# Altium project BMS.PrjPcb
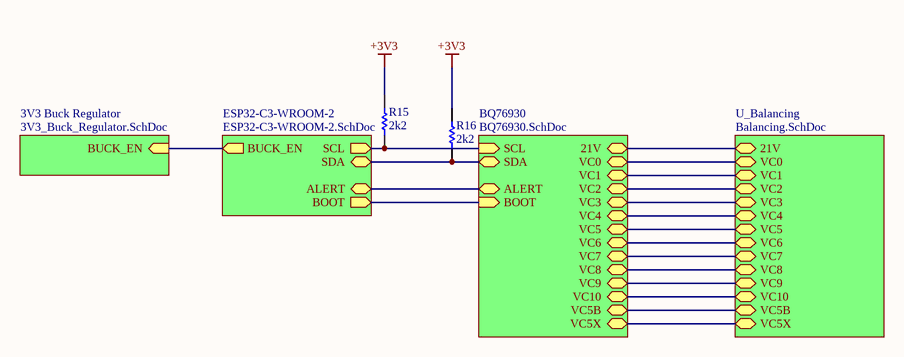
[diagram p0: Topdesign.SchDoc]
5 sheets, 125 parts. Net scope: hierarchical (ports join the sheet entries above them; power ports are global).
Board file: BMS-PCB.PcbDoc
Sheets:
  Topdesign.SchDoc
    ESP32-C3-WROOM-2 = ESP32-C3-WROOM-2.SchDoc
    BQ76930 = BQ76930.SchDoc
    3V3 Buck Regulator = 3V3_Buck_Regulator.SchDoc
    U_Balancing = Balancing.SchDoc

## Sheet Topdesign.SchDoc
size A4; SheetNumber: 1; SheetTotal: 5

### Parts
R15  value 2k2  [Wurth 0603 Resistor]  (hidden comment: Generic Resistor 2k2 0603)
R16  value 2k2  [Wurth 0603 Resistor]  (hidden comment: Generic Resistor 2k2 0603)

### Sub-sheets
3V3 Buck Regulator = 3V3_Buck_Regulator.SchDoc: BUCK_EN (in)
BQ76930 = BQ76930.SchDoc: SCL (in), SDA (bidir), BOOT (in), ALERT (bidir), VC5X (bidir), VC0 (bidir), VC1 (bidir), VC2 (bidir), VC3 (bidir), VC4 (bidir), VC5 (bidir), VC6 (bidir), VC7 (bidir), VC8 (bidir), VC9 (bidir), VC10 (bidir), VC5B (bidir), 21V (bidir)
ESP32-C3-WROOM-2 = ESP32-C3-WROOM-2.SchDoc: SCL (out), SDA (bidir), ALERT (bidir), BOOT (out), BUCK_EN (out)
U_Balancing = Balancing.SchDoc: VC0 (bidir), VC1 (bidir), VC2 (bidir), VC3 (bidir), VC4 (bidir), VC5 (bidir), VC6 (bidir), VC7 (bidir), VC8 (bidir), VC9 (bidir), VC10 (bidir), VC5B (bidir), 21V (bidir), VC5X (bidir)

### Nets
+3V3: R15.2 R16.2
21V: sheet BQ76930/21V, sheet U_Balancing/21V
KEEP_ON: sheet ESP32-C3-WROOM-2/BUCK_EN, sheet 3V3 Buck Regulator/BUCK_EN
VC5X: sheet BQ76930/VC5X, sheet U_Balancing/VC5X
NetC17_1: sheet BQ76930/VC4, sheet U_Balancing/VC4
NetC17_2: sheet BQ76930/VC5, sheet U_Balancing/VC5
NetC18_1: sheet BQ76930/VC9, sheet U_Balancing/VC9
NetC18_2: sheet BQ76930/VC10, sheet U_Balancing/VC10
NetC19_1: sheet BQ76930/VC3, sheet U_Balancing/VC3
NetC20_1: sheet BQ76930/VC8, sheet U_Balancing/VC8
NetC21_1: sheet BQ76930/VC2, sheet U_Balancing/VC2
NetC22_1: sheet BQ76930/VC7, sheet U_Balancing/VC7
NetC23_1: sheet BQ76930/VC1, sheet U_Balancing/VC1
NetC24_1: sheet BQ76930/VC6, sheet U_Balancing/VC6
NetC27_2: sheet BQ76930/VC0, sheet U_Balancing/VC0
NetC28_1: sheet BQ76930/VC5B, sheet U_Balancing/VC5B
NetD5_1: sheet ESP32-C3-WROOM-2/BOOT, sheet BQ76930/BOOT
NetIC2_4: R16.1 ; sheet ESP32-C3-WROOM-2/SDA, sheet BQ76930/SDA
NetIC2_5: R15.1 ; sheet ESP32-C3-WROOM-2/SCL, sheet BQ76930/SCL
NetIC2_30: sheet ESP32-C3-WROOM-2/ALERT, sheet BQ76930/ALERT

## Sheet ESP32-C3-WROOM-2.SchDoc
size A4; SheetNumber: 2; SheetTotal: 5
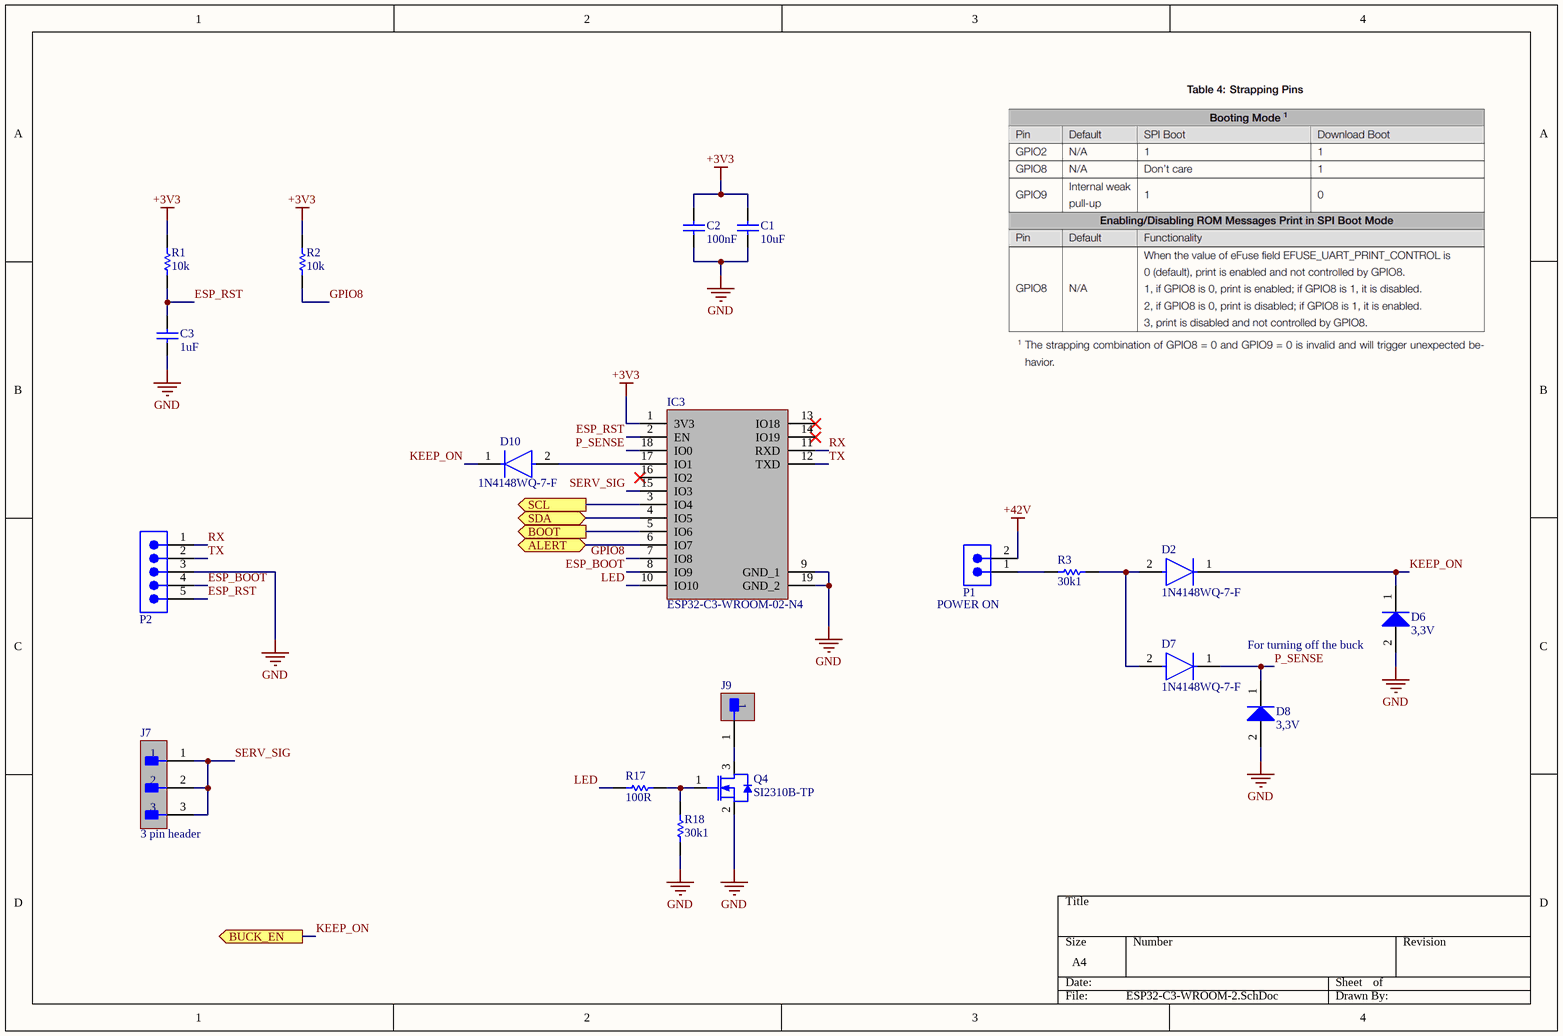
[diagram p1: ESP32-C3-WROOM-2.SchDoc]

### Parts
C1  value 10uF  [Wurth 0603 capacitor]  (hidden comment: Generic Capacitor 10uF 0603)
C2  value 100nF  [Wurth 0603 capacitor]  (hidden comment: Generic Capacitor 100nF 0603)
C3  value 1uF  [Wurth 0603 capacitor]  (hidden comment: Generic Capacitor 1uF 0603)
D2  1N4148WQ-7-F  [FP-SOD123-MFG]
D6  value 3,3V  [SOD-123]  (hidden comment: BZT52C3V3)
D7  1N4148WQ-7-F  [FP-SOD123-MFG]
D8  value 3,3V  [SOD-123]  (hidden comment: BZT52C3V3)
D10  1N4148WQ-7-F  [FP-SOD123-MFG]
IC3  ESP32-C3-WROOM-02-N4  [Espressif ESP32C3WROOM02N4]
J7  3 pin header  [3 pin header 2.54mm]
J9  1 pin header  [1 pin header]  (value not drawn)
P1  POWER ON  [2x1 2.54mm M]
P2  61300511121  [5x1 2.54mm]  (value not drawn)
Q4  SI2310B-TP  [MCC SOT-23-3]
R1  value 10k  [Wurth 0603 Resistor]  (hidden comment: Generic Resistor 10k 0603)
R2  value 10k  [Wurth 0603 Resistor]  (hidden comment: Generic Resistor 10k 0603)
R3  value 30k1  [Wurth 0603 Resistor]  (hidden comment: Generic Resistor 30k1 0603)
R17  value 100R  [Wurth 0603 Resistor]  (hidden comment: Generic Resistor 100R 0603)
R18  value 30k1  [Wurth 0603 Resistor]  (hidden comment: Generic Resistor 30k1 0603)

### Ports
ALERT (bidir), BOOT (out), BUCK_EN (out), SCL (out), SDA (bidir)

### Nets
+3V3: C1.2 C2.2 IC3.1(3V3) R1.2 R2.2
+42V: P1.2
GND: C1.1 C2.1 C3.1 D6.2(A) D8.2(A) IC3.9(GND_1) IC3.19(GND_2) P2.3 Q4.2(S) R18.1
ESP_BOOT: IC3.8(IO9) P2.4
ESP_RST: C3.2 IC3.2(EN) P2.5 R1.1
GPIO8: IC3.7(IO8) R2.1
KEEP_ON: D2.1(C) D6.1(K) D10.1(C) ; port BUCK_EN
LED: IC3.10(IO10) R17.1
P_SENSE: D7.1(C) D8.1(K) IC3.18(IO0)
RX: IC3.11(RXD) P2.1
SERV_SIG: IC3.15(IO3) J7.1 J7.2 J7.3
TX: IC3.12(TXD) P2.2
NetD2_2: D2.2(A) D7.2(A) R3.2
NetD5_1: IC3.5(IO6) ; port BOOT
NetD10_2: D10.2(A) IC3.17(IO1)
NetIC2_4: IC3.4(IO5) ; port SDA
NetIC2_5: IC3.3(IO4) ; port SCL
NetIC2_30: IC3.6(IO7) ; port ALERT
NetJ9_1: J9.1 Q4.3(D)
NetP1_1: P1.1 R3.1
NetQ4_1: Q4.1(G) R17.2 R18.2

Not connected (* = marked no-connect by the designer): IC3 13(IO18)* 14(IO19)* 16(IO2)*

### Notes on the sheet
- (near D6) For turning off the buck

### Library data of the parts
D2 D7 D10 = CMP-12791-000025-1: DIODE GEN PURP 100V 300MA SOD123; Manufacturer: Diodes Inc.; Value: 2pF; Standoff Height: 0mm; Automotive Grade: Grade 0; Max Junction Temp: +150°C; Max Surge Forward Current: 1A; Peak Reverse Current: 1uA; Forward Current: 300mA; Temperature: -65°C to +150°C; Device Class L3: Rectifier Diodes; Manufacturer Part Number: 1N4148WQ-7-F; Temperature Range Low: -65°C; Device Class L1: Discrete Semiconductors; Reverse Voltage: 100V; Automotive: Yes; Temperature Range High: +150°C; Octopart: https://octopart.com/1n4148wq-7-f-diodes+inc.-34965875; ComponentLink2URL: https://www.diodes.com/assets/Datasheets/ds30086.pdf; Max Repetitive Reverse Voltage: 100V; Mouser Description: Diode Switching 100V 0.15A Automotive 2-Pin SOD-123 T/R; Ipc Land Pattern Name: SOD365155X123-2; RoHS: TRUE; Height: 1.45mm; ComponentLink2Description: Datasheet; Category: Diode; Footprint Url: https://www.diodes.com/assets/Package-Files/SOD123.pdf; Package: SOD123; Device Class L2: Diodes; Lead Free: Yes; Capacitance: 2pF; Digikey Description: DIODE GEN PURP 100V 300MA SOD123
D6 D8 = GOODWORK BZT52C3V3
IC3 = Espressif ESP32-C3-WROOM-02-N4: Integrated Circuit; Manufacturer_Name: Espressif Systems; Datasheet Link: https://www.mouser.ch/datasheet/2/891/Espressif_ESP32_C3_WROOM_02-2006871.pdf; Height: 3.35mm; Manufacturer_Part_Number: ESP32-C3-WROOM-02-N4; Mouser Part Number: 356-ESP32C3WROOM02N4; Mouser Price/Stock: https://www.mouser.co.uk/ProductDetail/Espressif-Systems/ESP32-C3-WROOM-02-N4?qs=stqOd1AaK7%2FqjTZKEOgfUg%3D%3D; Supplier: Mouser; Supplier Part Number: 356-ESP32C3WROOM02N4
P1 = 2P: WR-PHD Pin Header, THT, Vertical, pitch 2.54mm, 1 Row, 2P; Manufacturer Part Number: 61300211121; Manufacturer: Wurth Elektronik; Contact Resistance: 20mOhm; Rated Current: 3A; Working Voltage: 250V; Withstanding Voltage: 500V; Category: Board-to-Board Connectors; Match Code: WR-PHD; ComponentLink1Description: Website Link; ComponentLink1URL: https://www.we-online.com/redexpert/article/61300211121?ad; ComponentLink2Description: Datasheet Link; ComponentLink2URL: https://www.we-online.com/redexpert/spec/61300211121?ad; Mount: Through Hole; Operating Temperature Max: 105°C; Operating Temperature Min: -40°C; Packaging: Bag; Gender: Pin Header; Number of Pins: 2; Number of Rows: 1; Orientation: Vertical; Pitch: 2.54mm
P2 = 5P: WR-PHD Pin Header, THT, Vertical, pitch 2.54mm, 1 Row, 5P; Manufacturer: Wurth Elektronik; Contact Resistance: 20mOhm; Rated Current: 3A; Working Voltage: 250V; Withstanding Voltage: 500V; Manufacturer Part Number: 61300511121; Category: Board-to-Board Connectors; Match Code: WR-PHD; ComponentLink1Description: Website Link; ComponentLink1URL: https://www.we-online.com/redexpert/article/61300511121?ad; ComponentLink2Description: Datasheet Link; ComponentLink2URL: https://www.we-online.com/redexpert/spec/61300511121?ad; Mount: Through Hole; Operating Temperature Max: 105°C; Operating Temperature Min: -40°C; Packaging: Bag; Gender: Pin Header; Number of Pins: 5; Number of Rows: 1; Orientation: Vertical; Pitch: 2.54mm
Q4 = MCC SI2310B-TP: Power Field-Effect Transistor; Manufacturer: MCC; Supplier: Digikey; Supplier Part Number: 353-SI2310B-TPCT-ND; Manufacturer Part Number: SI2310B-TP; RoHS: Yes; Stock: 114263; Pricing: 1=0,36, 10=0,255, 100=0,1286, 500=0,10488, 1000=0,07782 (USD)

## Sheet BQ76930.SchDoc
size A4; SheetNumber: 3; SheetTotal: 5
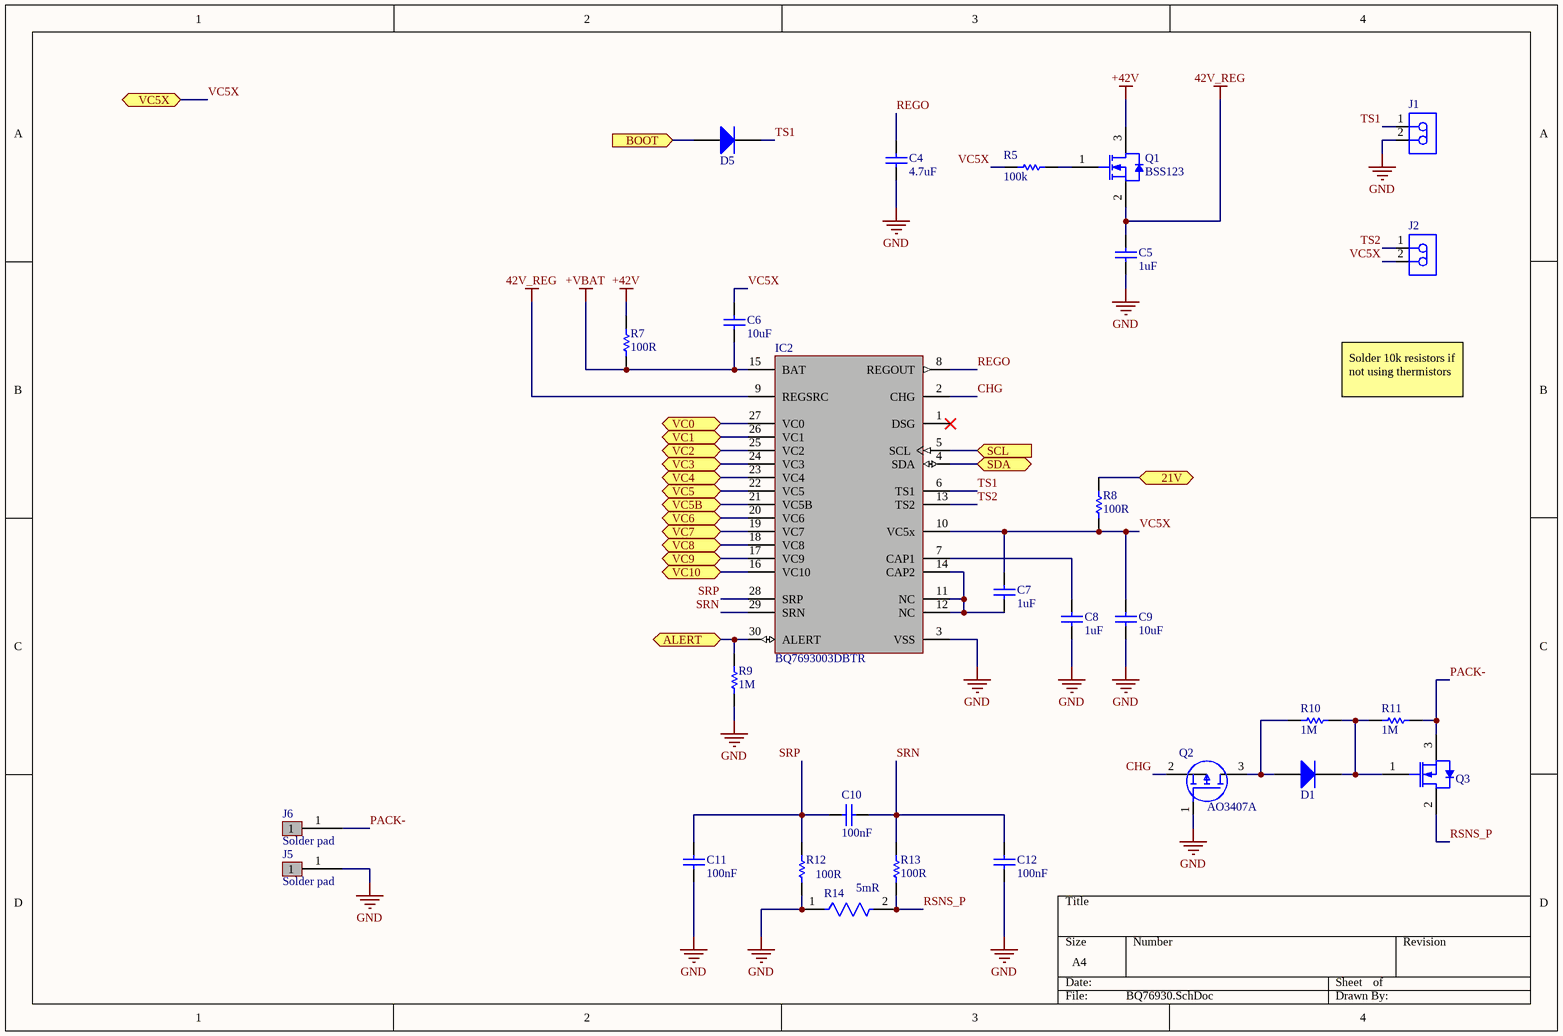
[diagram p2: BQ76930.SchDoc]

### Parts
C4  value 4.7uF  [Wurth 0603 capacitor]  (hidden comment: Generic Capacitor 4.7uF 0603)
C5  value 1uF  [Wurth 0603 capacitor]  (hidden comment: Generic Capacitor 1uF 0603)
C6  value 10uF  [Wurth 0603 capacitor]  (hidden comment: Generic Capacitor 10uF 0603)
C7  value 1uF  [Wurth 0603 capacitor]  (hidden comment: Generic Capacitor 1uF 0603)
C8  value 1uF  [Wurth 0603 capacitor]  (hidden comment: Generic Capacitor 1uF 0603)
C9  value 10uF  [Wurth 0603 capacitor]  (hidden comment: Generic Capacitor 10uF 0603)
C10  value 100nF  [Wurth 0603 capacitor]  (hidden comment: Generic Capacitor 100nF 0603)
C11  value 100nF  [Wurth 0603 capacitor]  (hidden comment: Generic Capacitor 100nF 0603)
C12  value 100nF  [Wurth 0603 capacitor]  (hidden comment: Generic Capacitor 100nF 0603)
D1  1N4148W-7-F  [DIOD-SOD123-2_V]  (value not drawn)
D5  1N4148W-7-F  [DIOD-SOD123-2_V]  (value not drawn)
IC2  BQ7693003DBTR  [Texas Instruments TSSOP-30 7.8X4.4MM]
J1  B2B-PH-K-S(LF)(SN)  [JST-B2B-PH-K-S_V]  (value not drawn)
J2  B2B-PH-K-S(LF)(SN)  [JST-B2B-PH-K-S_V]  (value not drawn)
J5  Solder pad  [Solder Pad 4X5MM]
J6  Solder pad  [Solder Pad 4X5MM]
Q1  BSS123  [FAIR-SOT23-3_V]
Q2  AO3407A  [UMW SOT23-3]
Q3  MDT18N20  [Minos TO-252-2L 6.3X9.6MM]  (value not drawn)
R5  value 100k  [Wurth 0603 Resistor]  (hidden comment: CRCW060310K0FKEA)
R7  value 100R  [Wurth 0603 Resistor]  (hidden comment: Generic Resistor 100R 0603)
R8  value 100R  [Wurth 0603 Resistor]  (hidden comment: Generic Resistor 100R 0603)
R9  value 1M  [Wurth 0603 Resistor]  (hidden comment: Generic Resistor 1M 0603)
R10  value 1M  [Wurth 0603 Resistor]  (hidden comment: Generic Resistor 1M 0603)
R11  value 1M  [Wurth 0603 Resistor]  (hidden comment: Generic Resistor 1M 0603)
R12  value 100R  [Wurth 0603 Resistor]  (hidden comment: Generic Resistor 100R 0603)
R13  value 100R  [Wurth 0603 Resistor]  (hidden comment: Generic Resistor 100R 0603)
R14  Resistance: 5mR  [FP-ERJM1WS-MFG]  (hidden comment: ERJ-M1WSF5M0U)

### Ports
21V (bidir), ALERT (bidir), BOOT (in), SCL (in), SDA (bidir), VC0 (bidir), VC1 (bidir), VC2 (bidir), VC3 (bidir), VC4 (bidir), VC5 (bidir), VC5B (bidir), VC5X (bidir), VC6 (bidir), VC7 (bidir), VC8 (bidir), VC9 (bidir), VC10 (bidir)

### Nets
42V_REG: C5.2 IC2.9(REGSRC) Q1.2(S)
+42V: Q1.3(D) R7.1
+VBAT: C6.1 IC2.15(BAT) R7.2
GND: C4.1 C5.1 C8.1 C9.1 C11.1 C12.1 IC2.3(VSS) J1.2 J5.1 Q2.1(G) R9.1 R12.1 R14.1
21V: R8.2 ; port 21V
CHG: IC2.2(CHG) Q2.2(S)
PACK-: J6.1 Q3.3(S) R11.2
REGO: C4.2 IC2.8(REGOUT)
RSNS_P: Q3.2(D) R13.1 R14.2
SRN: C10.2 C12.2 IC2.29(SRN) R13.2
SRP: C10.1 C11.2 IC2.28(SRP) R12.2
TS1: D5.2(K) IC2.6(TS1) J1.1
TS2: IC2.13(TS2) J2.1
VC5X: C6.2 C7.2 C9.2 IC2.10(VC5x) J2.2 R5.2 R8.1 ; port VC5X
NetC7_1: C7.1 IC2.11(NC) IC2.12(NC) IC2.14(CAP2)
NetC8_2: C8.2 IC2.7(CAP1)
NetC17_1: IC2.23(VC4) ; port VC4
NetC17_2: IC2.22(VC5) ; port VC5
NetC18_1: IC2.17(VC9) ; port VC9
NetC18_2: IC2.16(VC10) ; port VC10
NetC19_1: IC2.24(VC3) ; port VC3
NetC20_1: IC2.18(VC8) ; port VC8
NetC21_1: IC2.25(VC2) ; port VC2
NetC22_1: IC2.19(VC7) ; port VC7
NetC23_1: IC2.26(VC1) ; port VC1
NetC24_1: IC2.20(VC6) ; port VC6
NetC27_2: IC2.27(VC0) ; port VC0
NetC28_1: IC2.21(VC5B) ; port VC5B
NetD1_1: D1.1(A) Q2.3(D) R10.1
NetD1_2: D1.2(K) Q3.1(G) R10.2 R11.1
NetD5_1: D5.1(A) ; port BOOT
NetIC2_4: IC2.4(SDA) ; port SDA
NetIC2_5: IC2.5(SCL) ; port SCL
NetIC2_30: IC2.30(ALERT) R9.2 ; port ALERT
NetQ1_1: Q1.1(G) R5.1

Not connected (* = marked no-connect by the designer): IC2 1(DSG)*

### Notes on the sheet
- Solder 10k resistors if not using thermistors

### Library data of the parts
D1 D5 = CMP-2000-04932-2: Fast Switching Diode, 100 V, 0.15 A, -65 to 150 degC, 2-Pin?SOD123, RoHS, Tape and Reel; Recovery Time: 4ns; Brand: DiodesIncorporated; Unit Weight: 0.000353oz; Max Surge Current: 2A; Peak Reverse Voltage: 100V; Ir - Reverse Current: 1uA; Vf - Forward Voltage: 1.25V; Configuration: Single; If - Forward Current: 0.15A; Product Category: Diodes-GeneralPurpose,Power,Switching; Operating Temperature Range: -65Cto+150C; Packaging: Reel; Manufacturer URL: http://www.diodes.com/; Maximum Operating Temperature: +150C; Height: 1.25mm; Minimum Operating Temperature: -65C; Product: SwitchingDiodes; Package URL: http://www.diodes.com/datasheets/ds18004.pdf; Type: SwitchingDiode; Package Reference: SOD123-2; Width: 1.7mm; Datasheet URL: http://www.farnell.com/datasheets/1915529.pdf; Datasheet Version: Rev. 24-2, 10/2013; Series: 1N4148; Factory Pack Quantity: 3000; Length: 2.85mm; RoHS: True; Manufacturer: DiodesIncorporated; Mounting Style: SMD/SMT; Package / Case: SOD-123
IC2 = Texas instruments BQ7693003DBTR: Power Supply Support Circuit, Adjustable, 1 Channel, PDSO30; Max Supply Voltage: 25V; Nominal Supply Current: 40-130uA; Number Of Outputs: 2; Number Of Cells: 10; Standoff Height: 0.05mm; Min Supply Voltage: 6V; Package Body Material: Plastic; Adjustable Threshold: Yes; Number of Channels: 1; Octopart: https://octopart.com/bq7693003dbtr-texas+instruments-34472212; Digikey Description: IC BATT MGMT LI-ION AFE 30TSSOP; Manufacturer: Texas Instruments; Ipc Land Pattern Name: SOP50P635X120-30; Mouser Description: 6 to 10-Series Cell Li-Ion and Li-Phosphate Battery Monitor (bq76940 Family) 30-TSSOP -40 to 85; Package: DBT0030A; Manufacturer Part Number: BQ7693003DBTR; Device Class L1: Integrated Circuits (ICs); Temperature Range High: +85°C; RoHS: TRUE; Category: IC; Temperature: -40°C to +85°C; Automotive: No; Device Class L3: Battery Management; ComponentLink2Description: Datasheet; Device Class L2: Power Management ICs; ComponentLink2URL: http://www.ti.com/lit/ds/symlink/bq76930.pdf; Height: 1.2mm; Temperature Range Low: -40°C; Lead Free: Yes; Supplier: Mouser; Supplier Part Number: 595-BQ7693003DBTR; Stock: 4010; Pricing: 1=3,18, 10=2,75, 50=2,75, 100=2,54, 1000=2,15, 10000=1,96 (USD); Case/Package: TSSOP; Pins: 30; Package Shape: Rectangular; Terminal Finish: Nickel; Min Operating Temperature: -40°C; Max Operating Temperature: 85°C; JESD-609 Code: e4; Throw Configuration: POWER SUPPLY SUPPORT CIRCUIT; Moisture Sensitivity Level: 2; Channels: 1; Package Style: SMALL OUTLINE, THIN PROFILE, SHRINK PITCHMeter; Peak Reflow Temperature (Cel): 260°C; Surface Mount: Yes; Terminal Form: Gull Wing; Terminal Position: DUAL; Length: 7.8mm; Width: 4.4mm; Height - Seated (Max): 1.2mm; Terminal Pitch: 0.5mm; Reach SVHC Compliant: Yes; RoHS Compliant: Yes; Temperature Grade: INDUSTRIAL; ComponentLink1URL: https://www.ti.com:443/lit/ds/symlink/bq76920.pdf?src-supplier=IHS+Markit; ComponentLink1Description: https://www.ti.com:443/lit/ds/symlink/bq76920.pdf?src-supplier=IHS+Markit; ComponentLink3URL: http://www.ti.com/lit/gpn/bq76930?src-supplier=Mouser; ComponentLink3Description: http://www.ti.com/lit/gpn/bq76930?src-supplier=Mouser; ComponentLink4URL: http://www.ti.com/lit/ds/symlink/bq76930.pdf?src-supplier=Digikey; ComponentLink4Description: http://www.ti.com/lit/ds/symlink/bq76930.pdf?src-supplier=Digikey; ComponentLink5URL: http://www.ti.com/lit/pdf/slpt038?src-supplier=Digikey; ComponentLink5Description: http://www.ti.com/lit/pdf/slpt038?src-supplier=Digikey; ComponentLink6URL: http://www.ti.com/general/docs/lit/getliterature.tsp?genericPartNumber=BQ76920&&fileType=pdf&src-supplier=Avnet; ComponentLink6Description: http://www.ti.com/general/docs/lit/getliterature.tsp?genericPartNumber=BQ76920&&fileType=pdf&src-supplier=Avnet
J1 J2 = CMP-2000-05162-1: Male Header, Pitch 2 mm, 1 x 2 Position, Height 6 mm, Tail Length 3.4 mm, -25 to 85 degC, RoHS, Bulk; Manufacturer: JST; Pitch: 2mm; Style/Orientation: StraightHeader/Plug; No of Positions: 2; Datasheet Version: Nov-08; Datasheet URL: http://datasheet.octopart.com/B2B-PH-K-S%28LF%29%28SN%29-JST-datasheet-8324864.pdf; Manufacturer URL: http://www.jst.com/home2.html; Type: ShroudedHeader; Termination: Crimp
Q1 = CMP-2000-04934-1: N-Channel Logic Level Enhancement Mode Field Effect Transistor, 1.7 V, -55 to 150 degC, 3-Pin SOT-23, RoHS, Tape and Reel; Manufacturer: Fairchild; Channel Type: N; Typical Turn-Off Delay Time: 17ns; Maximum Continuous Drain Current: 0.17A; Rad Hard: No; Typical Rise Time: 9ns; Typical Fall Time: 2.4ns; Maximum Gate Source Voltage: ±20V; Maximum Drain Source Voltage: 100V; Typical Turn-On Delay Time: 1.7ns; RDS-on: 6000@10VmOhm; Package Version: Rev. 12, 03/2016; Packaging: Tape&Reel; Package Reference: SOT23-3; Channel Mode: Enhancement; Operating Temperature: -55to150degC; Package Description: 3-Pin Small Outline Transistor, Body 2.92 x 1.325 mm, Pitch 0.95 mm; Category: MOSFET; Datasheet Version: Jun-03; Datasheet URL: https://www.fairchildsemi.com/datasheets/BS/BSS123.pdf; Manufacturer URL: https://www.fairchildsemi.com/; Mounting: SurfaceMount; Package: 3SOT-23; Package URL: http://www.fairchildsemi.com/dwg/MA/MA03D.pdf
Q2 = UMW AO3407A: MOSFET (P-Channel); Manufacturer_Name: Alpha & Omega Semiconductors; Datasheet Link: http://www.aosmd.com/pdfs/datasheet/ao3407a.pdf; Height: 1.25mm; Manufacturer_Part_Number: AO3407A; Arrow Part Number: AO3407A; Arrow Price/Stock: https://www.arrow.com/en/products/ao3407a/alpha-and-omega-semiconductor?region=nac
Q3 = Minos MDT18N20: VDS = 200V,ID = 18A, VGS=30V
R5 = Generic Resistor 100k 0603
R14 = CMP-05422-000103-1: RES 0.005 OHM 1% 1W 2512; Temperature Coefficient: 100ppm/°C; Construction: Rectangular; Mount: Surface Mount; Case/Package: 2512; Package Quantity: 1; Technology: THICK FILM; RoHS Compliant: Yes; REACH SVHC: No SVHC; Size Code: 2512; Number of Terminations: 2; Max Operating Temperature: 170°C; Number of Pins: 2; Case Code (Metric): 6432; Depth: 3.2mm; Case Code (Imperial): 2512; Max Power Dissipation: 1W; Termination: SMD/SMT; Power Rating: 1W; Radiation Hardening: No; Tolerance: 1%; Packaging: Tape and Reel; Resistor Type: Metal Strip; Military Standard: Not; Lead Free: Lead Free; Height: 0.8mm; Min Operating Temperature: -55°C; Width: 3.2mm; Series: ERJ; Length: 6.4mm; Resistance Tolerance: 1%; Contact Plating: Tin

## Sheet 3V3_Buck_Regulator.SchDoc
size A4; SheetNumber: 4; SheetTotal: 5
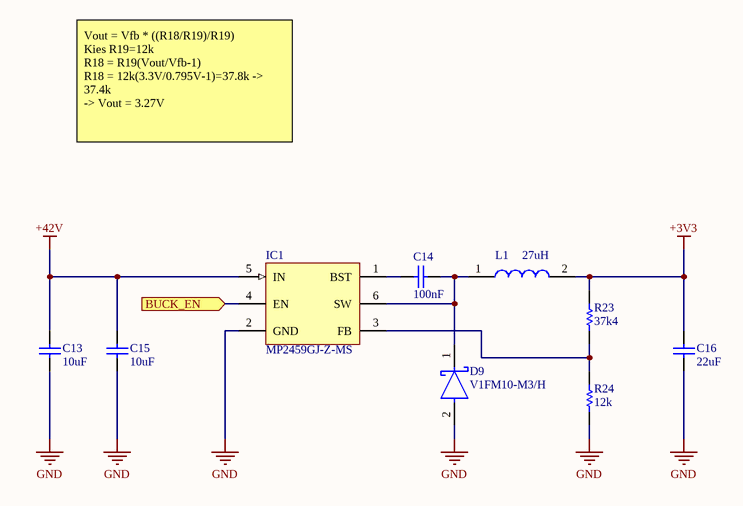
[diagram p3: 3V3_Buck_Regulator.SchDoc]

### Parts
C13  value 10uF  [Wurth 0805 capacitor]  (hidden comment: Generic Capacitor 10uF 0805)
C14  value 100nF  [Wurth 0603 capacitor]  (hidden comment: Generic Capacitor 100nF 0603)
C15  value 10uF  [Wurth 0805 capacitor]  (hidden comment: Generic Capacitor 10uF 0805)
C16  value 22uF  [Wurth 0805 capacitor]  (hidden comment: Generic Capacitor 22uF 0805)
D9  V1FM10-M3/H  [FP-V1FM10-M3-H-MFG]
IC1  MP2459GJ-Z-MS  [Texas InstrumentsSOT95P280X110-6N]
L1  value 27uH  [3L COILS 5.2X5.8MM]  (hidden comment: COILS SMTDR54-270M)
R23  value 37k4  [Wurth 0603 Resistor]  (hidden comment: Generic Resistor 37k4 0603)
R24  value 12k  [Wurth 0603 Resistor]  (hidden comment: Generic Resistor 12k 0603)

### Ports
BUCK_EN (in)

### Nets
+3V3: C16.2 L1.2 R23.2
+42V: C13.2 C15.2 IC1.5(IN)
GND: C13.1 C15.1 C16.1 D9.2(A) IC1.2(GND) R24.1
KEEP_ON: IC1.4(EN) ; port BUCK_EN
NetC14_1: C14.1 IC1.1(BST)
NetC14_2: C14.2 D9.1(C) IC1.6(SW) L1.1
NetIC1_3: IC1.3(FB) R23.1 R24.2

### Notes on the sheet
- Vout = Vfb * ((R18/R19)/R19)
  Kies R19=12k
  R18 = R19(Vout/Vfb-1)
  R18 = 12k(3.3V/0.795V-1)=37.8k -> 37.4k
  -> Vout = 3.27V

### Library data of the parts
D9 = CMP-02539-000045-1: 1A 100V SMF TRENCH SKY RECT; RoHS Compliant: Yes
IC1 = MSKSEMI MP2459GJ-Z-MS: Buck Converter 4.5V-60V 600mA
L1 = 3L COILS SMTDR54-270M inductor: Manufacturer: 3L Coils

## Sheet Balancing.SchDoc
size A4; SheetNumber: 5; SheetTotal: 5
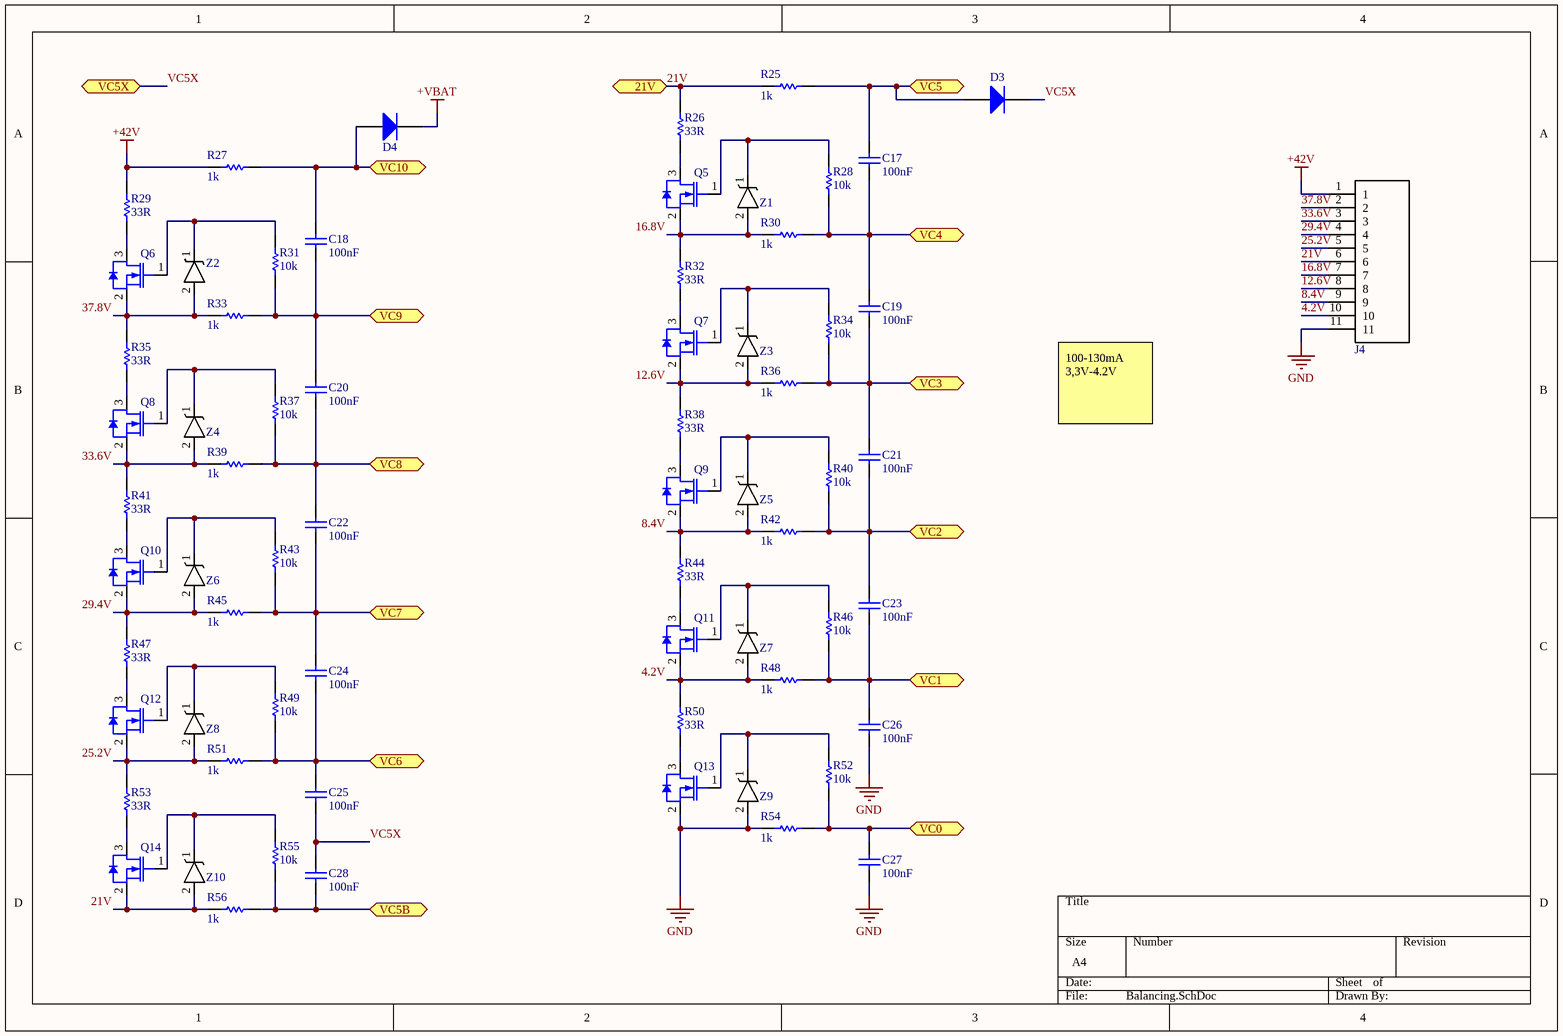
[diagram p4: Balancing.SchDoc]

### Parts
C17  value 100nF  [Wurth 0603 capacitor]  (hidden comment: Generic Capacitor 100nF 0603)
C18  value 100nF  [Wurth 0603 capacitor]  (hidden comment: Generic Capacitor 100nF 0603)
C19  value 100nF  [Wurth 0603 capacitor]  (hidden comment: Generic Capacitor 100nF 0603)
C20  value 100nF  [Wurth 0603 capacitor]  (hidden comment: Generic Capacitor 100nF 0603)
C21  value 100nF  [Wurth 0603 capacitor]  (hidden comment: Generic Capacitor 100nF 0603)
C22  value 100nF  [Wurth 0603 capacitor]  (hidden comment: Generic Capacitor 100nF 0603)
C23  value 100nF  [Wurth 0603 capacitor]  (hidden comment: Generic Capacitor 100nF 0603)
C24  value 100nF  [Wurth 0603 capacitor]  (hidden comment: Generic Capacitor 100nF 0603)
C25  value 100nF  [Wurth 0603 capacitor]  (hidden comment: Generic Capacitor 100nF 0603)
C26  value 100nF  [Wurth 0603 capacitor]  (hidden comment: Generic Capacitor 100nF 0603)
C27  value 100nF  [Wurth 0603 capacitor]  (hidden comment: Generic Capacitor 100nF 0603)
C28  value 100nF  [Wurth 0603 capacitor]  (hidden comment: Generic Capacitor 100nF 0603)
D3  1N4148W-7-F  [DIOD-SOD123-2_V]  (value not drawn)
D4  1N4148W-7-F  [DIOD-SOD123-2_V]  (value not drawn)
J4  S11B-PH-K-S_LF__SN_  [S11BPHKSLFSN]  (value not drawn)
Q5  DMN2004K-7  [Diodes SOT23-3]  (value not drawn)
Q6  DMN2004K-7  [Diodes SOT23-3]  (value not drawn)
Q7  DMN2004K-7  [Diodes SOT23-3]  (value not drawn)
Q8  DMN2004K-7  [Diodes SOT23-3]  (value not drawn)
Q9  DMN2004K-7  [Diodes SOT23-3]  (value not drawn)
Q10  DMN2004K-7  [Diodes SOT23-3]  (value not drawn)
Q11  DMN2004K-7  [Diodes SOT23-3]  (value not drawn)
Q12  DMN2004K-7  [Diodes SOT23-3]  (value not drawn)
Q13  DMN2004K-7  [Diodes SOT23-3]  (value not drawn)
Q14  DMN2004K-7  [Diodes SOT23-3]  (value not drawn)
R25  value 1k  [Wurth 0603 Resistor]  (hidden comment: CRCW060310K0FKEA)
R26  value 33R  [FOJAN 2010 Resistor]  (hidden comment: FRC2010F33R0TS)
R27  value 1k  [Wurth 0603 Resistor]  (hidden comment: CRCW060310K0FKEA)
R28  value 10k  [Wurth 0603 Resistor]  (hidden comment: Generic Resistor 10k 0603)
R29  value 33R  [FOJAN 2010 Resistor]  (hidden comment: FRC2010F33R0TS)
R30  value 1k  [Wurth 0603 Resistor]  (hidden comment: CRCW060310K0FKEA)
R31  value 10k  [Wurth 0603 Resistor]  (hidden comment: Generic Resistor 10k 0603)
R32  value 33R  [FOJAN 2010 Resistor]  (hidden comment: FRC2010F33R0TS)
R33  value 1k  [Wurth 0603 Resistor]  (hidden comment: CRCW060310K0FKEA)
R34  value 10k  [Wurth 0603 Resistor]  (hidden comment: Generic Resistor 10k 0603)
R35  value 33R  [FOJAN 2010 Resistor]  (hidden comment: FRC2010F33R0TS)
R36  value 1k  [Wurth 0603 Resistor]  (hidden comment: CRCW060310K0FKEA)
R37  value 10k  [Wurth 0603 Resistor]  (hidden comment: Generic Resistor 10k 0603)
R38  value 33R  [FOJAN 2010 Resistor]  (hidden comment: FRC2010F33R0TS)
R39  value 1k  [Wurth 0603 Resistor]  (hidden comment: CRCW060310K0FKEA)
R40  value 10k  [Wurth 0603 Resistor]  (hidden comment: Generic Resistor 10k 0603)
R41  value 33R  [FOJAN 2010 Resistor]  (hidden comment: FRC2010F33R0TS)
R42  value 1k  [Wurth 0603 Resistor]  (hidden comment: CRCW060310K0FKEA)
R43  value 10k  [Wurth 0603 Resistor]  (hidden comment: Generic Resistor 10k 0603)
R44  value 33R  [FOJAN 2010 Resistor]  (hidden comment: FRC2010F33R0TS)
R45  value 1k  [Wurth 0603 Resistor]  (hidden comment: CRCW060310K0FKEA)
R46  value 10k  [Wurth 0603 Resistor]  (hidden comment: Generic Resistor 10k 0603)
R47  value 33R  [FOJAN 2010 Resistor]  (hidden comment: FRC2010F33R0TS)
R48  value 1k  [Wurth 0603 Resistor]  (hidden comment: CRCW060310K0FKEA)
R49  value 10k  [Wurth 0603 Resistor]  (hidden comment: Generic Resistor 10k 0603)
R50  value 33R  [FOJAN 2010 Resistor]  (hidden comment: FRC2010F33R0TS)
R51  value 1k  [Wurth 0603 Resistor]  (hidden comment: CRCW060310K0FKEA)
R52  value 10k  [Wurth 0603 Resistor]  (hidden comment: Generic Resistor 10k 0603)
R53  value 33R  [FOJAN 2010 Resistor]  (hidden comment: FRC2010F33R0TS)
R54  value 1k  [Wurth 0603 Resistor]  (hidden comment: CRCW060310K0FKEA)
R55  value 10k  [Wurth 0603 Resistor]  (hidden comment: Generic Resistor 10k 0603)
R56  value 1k  [Wurth 0603 Resistor]  (hidden comment: CRCW060310K0FKEA)
Z1  MMSZ5232BS-7-F  [Diodes SOD-323]  (value not drawn)
Z2  MMSZ5232BS-7-F  [Diodes SOD-323]  (value not drawn)
Z3  MMSZ5232BS-7-F  [Diodes SOD-323]  (value not drawn)
Z4  MMSZ5232BS-7-F  [Diodes SOD-323]  (value not drawn)
Z5  MMSZ5232BS-7-F  [Diodes SOD-323]  (value not drawn)
Z6  MMSZ5232BS-7-F  [Diodes SOD-323]  (value not drawn)
Z7  MMSZ5232BS-7-F  [Diodes SOD-323]  (value not drawn)
Z8  MMSZ5232BS-7-F  [Diodes SOD-323]  (value not drawn)
Z9  MMSZ5232BS-7-F  [Diodes SOD-323]  (value not drawn)
Z10  MMSZ5232BS-7-F  [Diodes SOD-323]  (value not drawn)

### Ports
21V (bidir), VC0 (bidir), VC1 (bidir), VC2 (bidir), VC3 (bidir), VC4 (bidir), VC5 (bidir), VC5B (bidir), VC5X (bidir), VC6 (bidir), VC7 (bidir), VC8 (bidir), VC9 (bidir), VC10 (bidir)

### Nets
+42V: J4.1 R27.2 R29.2
+VBAT: D4.2(K)
GND: C26.1 C27.1 J4.11 Q13.2(S) R54.2 Z9.2(A)
4.2V: J4.10 Q11.2(S) R48.2 R50.2 Z7.2(A)
8.4V: J4.9 Q9.2(S) R42.2 R44.2 Z5.2(A)
12.6V: J4.8 Q7.2(S) R36.2 R38.2 Z3.2(A)
16.8V: J4.7 Q5.2(S) R30.2 R32.2 Z1.2(A)
21V: J4.6 Q14.2(S) R25.2 R26.2 R56.2 Z10.2(A) ; port 21V
25.2V: J4.5 Q12.2(S) R51.2 R53.2 Z8.2(A)
29.4V: J4.4 Q10.2(S) R45.2 R47.2 Z6.2(A)
33.6V: J4.3 Q8.2(S) R39.2 R41.2 Z4.2(A)
37.8V: J4.2 Q6.2(S) R33.2 R35.2 Z2.2(A)
VC5X: C25.1 C28.2 D3.2(K) ; port VC5X
NetC17_1: C17.1 C19.2 R28.1 R30.1 ; port VC4
NetC17_2: C17.2 D3.1(A) R25.1 ; port VC5
NetC18_1: C18.1 C20.2 R31.1 R33.1 ; port VC9
NetC18_2: C18.2 D4.1(A) R27.1 ; port VC10
NetC19_1: C19.1 C21.2 R34.1 R36.1 ; port VC3
NetC20_1: C20.1 C22.2 R37.1 R39.1 ; port VC8
NetC21_1: C21.1 C23.2 R40.1 R42.1 ; port VC2
NetC22_1: C22.1 C24.2 R43.1 R45.1 ; port VC7
NetC23_1: C23.1 C26.2 R46.1 R48.1 ; port VC1
NetC24_1: C24.1 C25.2 R49.1 R51.1 ; port VC6
NetC27_2: C27.2 R52.1 R54.1 ; port VC0
NetC28_1: C28.1 R55.1 R56.1 ; port VC5B
NetQ5_1: Q5.1(G) R28.2 Z1.1(K)
NetQ5_3: Q5.3(D) R26.1
NetQ6_1: Q6.1(G) R31.2 Z2.1(K)
NetQ6_3: Q6.3(D) R29.1
NetQ7_1: Q7.1(G) R34.2 Z3.1(K)
NetQ7_3: Q7.3(D) R32.1
NetQ8_1: Q8.1(G) R37.2 Z4.1(K)
NetQ8_3: Q8.3(D) R35.1
NetQ9_1: Q9.1(G) R40.2 Z5.1(K)
NetQ9_3: Q9.3(D) R38.1
NetQ10_1: Q10.1(G) R43.2 Z6.1(K)
NetQ10_3: Q10.3(D) R41.1
NetQ11_1: Q11.1(G) R46.2 Z7.1(K)
NetQ11_3: Q11.3(D) R44.1
NetQ12_1: Q12.1(G) R49.2 Z8.1(K)
NetQ12_3: Q12.3(D) R47.1
NetQ13_1: Q13.1(G) R52.2 Z9.1(K)
NetQ13_3: Q13.3(D) R50.1
NetQ14_1: Q14.1(G) R55.2 Z10.1(K)
NetQ14_3: Q14.3(D) R53.1

### Notes on the sheet
- 100-130mA 3,3V-4.2V

### Library data of the parts
D3 D4 = CMP-2000-04932-2: as D1 on sheet BQ76930; Product Category: Diodes-GeneralPurpose,Power,Switching; Operating Temperature Range: -65Cto+150C; Packaging: Reel; Manufacturer URL: http://www.diodes.com/; Maximum Operating Temperature: +150C; Height: 1.25mm; Minimum Operating Temperature: -65C; Product: SwitchingDiodes; Package URL: http://www.diodes.com/datasheets/ds18004.pdf; Type: SwitchingDiode; Package Reference: SOD123-2; Width: 1.7mm; Datasheet URL: http://www.farnell.com/datasheets/1915529.pdf; Datasheet Version: Rev. 24-2, 10/2013; Series: 1N4148; Factory Pack Quantity: 3000; Length: 2.85mm; RoHS: True; Manufacturer: DiodesIncorporated; Mounting Style: SMD/SMT; Package / Case: SOD-123
J4 = S11B-PH-K-S_LF__SN_: Connector; Manufacturer_Name: JST (JAPAN SOLDERLESS TERMINALS); Manufacturer_Part_Number: S11B-PH-K-S(LF)(SN); Datasheet Link: http://www.farnell.com/datasheets/2057211.pdf; Height: 4.8mm; Arrow Part Number: S11B-PH-K-S(LF)(SN); Arrow Price/Stock: https://www.arrow.com/en/products/s11b-ph-k-s-lf-sn/jst-manufacturing
Q5-Q14 = Diodes DMN2004K-7: MOSFET N-CH 20V 0.63A SOT23-3; Manufacturer: Diodes Inc.; Drain To Source Resistance: 0.4Ω; Turn Off Delay Time: 59.4ns; Continuous Drain Current: 630mA; Pulse Drain Current: 1.5A; Gate To Source Voltage: 8V; Reverse Recovery Time: 5.5ns; Number Of N Channels: 1; Depletion Mode: False; Max Forward Diode Voltage: 1V; Threshold Vgs Min: 0.5V; Turn On Delay Time: 5.7ns; Standoff Height: 0.013mm; Input Capacitace At Vds: 150pF @ 16V; Rthja Max: 357°C/W; Reverse Recovery Charge: 0.85nC; Automotive Grade: Grade 0; Max Junction Temp: +150°C; Power Dissipation: 350mW; Gate Charge At Vgs: 0.9nC @ 4.5V; Octopart: https://octopart.com/dmn2004k-7-diodes+inc.-7127688; Mouser Description: MOSFET 20V 540mA; Lead Free: Yes; Footprint Url: https://www.diodes.com/assets/Package-Files/SOT23.pdf; Height: 1.1mm; Temperature: -65°C to +150°C; Device Class L2: Transistors; Device Class L1: Discrete Semiconductors; ComponentLink2Description: Datasheet; RoHS: TRUE; Device Class L3: MOSFETs; Manufacturer Part Number: DMN2004K-7; Threshold Vgs Max: 1V; Number Of Channels: 1; Automotive: Yes; Category: Trans; Temperature Range Low: -65°C; Drain To Source Voltage: 20V; Drain To Source Breakdown Voltage: 20V; ComponentLink2URL: https://www.diodes.com/assets/Datasheets/ds30938.pdf; Temperature Range High: +150°C; Package: SOT23; Digikey Description: MOSFET N-CH 20V 0.63A SOT23-3
R25 R27 R30 R33 R36 R39 R42 R45 R48 R51 R54 R56 = Generic Resistor 1k 0603
R26 R29 R32 R35 R38 R41 R44 R47 R50 R53 = FOJAN FRC2010F33R0TS: 33ohm ±1% 200V ±100ppm/℃ , 750mW, 1010; Manufacturer: Fojan
Z1-Z10 = Diodes MMSZ5232BS-7-F: Zener Diode; Manufacturer_Name: Diodes Incorporated; Datasheet Link: https://www.diodes.com/assets/Datasheets/ds31038.pdf; Height: 1.2mm; Manufacturer_Part_Number: MMSZ5232BS-7-F; Mouser Part Number: 621-MMSZ5232BS-F; Mouser Price/Stock: https://www.mouser.co.uk/ProductDetail/Diodes-Incorporated/MMSZ5232BS-7-F?qs=4u4ada%252BXaA6tF4wEjgPe2w%3D%3D; Arrow Part Number: MMSZ5232BS-7-F; Arrow Price/Stock: https://www.arrow.com/en/products/mmsz5232bs-7-f/diodes-incorporated?region=nac

## Nets that join several sheets
+3V3: Topdesign (R15.2 R16.2), ESP32-C3-WROOM-2 (5 pins), 3V3_Buck_Regulator (C16.2 L1.2 R23.2)
+42V: ESP32-C3-WROOM-2 (P1.2), BQ76930 (Q1.3 R7.1), 3V3_Buck_Regulator (C13.2 C15.2 IC1.5), Balancing (J4.1 R27.2 R29.2)
+VBAT: BQ76930 (C6.1 IC2.15 R7.2), Balancing (D4.2)
GND: ESP32-C3-WROOM-2 (10 pins), BQ76930 (13 pins), 3V3_Buck_Regulator (6 pins), Balancing (6 pins)
21V: BQ76930 (R8.2), Balancing (6 pins)
KEEP_ON: ESP32-C3-WROOM-2 (D2.1 D6.1 D10.1), 3V3_Buck_Regulator (IC1.4)
NetC17_1: BQ76930 (IC2.23), Balancing (C17.1 C19.2 R28.1 R30.1)
NetC17_2: BQ76930 (IC2.22), Balancing (C17.2 D3.1 R25.1)
NetC18_1: BQ76930 (IC2.17), Balancing (C18.1 C20.2 R31.1 R33.1)
NetC18_2: BQ76930 (IC2.16), Balancing (C18.2 D4.1 R27.1)
NetC19_1: BQ76930 (IC2.24), Balancing (C19.1 C21.2 R34.1 R36.1)
NetC20_1: BQ76930 (IC2.18), Balancing (C20.1 C22.2 R37.1 R39.1)
NetC21_1: BQ76930 (IC2.25), Balancing (C21.1 C23.2 R40.1 R42.1)
NetC22_1: BQ76930 (IC2.19), Balancing (C22.1 C24.2 R43.1 R45.1)
NetC23_1: BQ76930 (IC2.26), Balancing (C23.1 C26.2 R46.1 R48.1)
NetC24_1: BQ76930 (IC2.20), Balancing (C24.1 C25.2 R49.1 R51.1)
NetC27_2: BQ76930 (IC2.27), Balancing (C27.2 R52.1 R54.1)
NetC28_1: BQ76930 (IC2.21), Balancing (C28.1 R55.1 R56.1)
NetD5_1: ESP32-C3-WROOM-2 (IC3.5), BQ76930 (D5.1)
NetIC2_4: Topdesign (R16.1), ESP32-C3-WROOM-2 (IC3.4), BQ76930 (IC2.4)
NetIC2_5: Topdesign (R15.1), ESP32-C3-WROOM-2 (IC3.3), BQ76930 (IC2.5)
NetIC2_30: ESP32-C3-WROOM-2 (IC3.6), BQ76930 (IC2.30 R9.2)
VC5X: BQ76930 (7 pins), Balancing (C25.1 C28.2 D3.2)